# EAGLE design main_board (EAGLE 7.4.0)
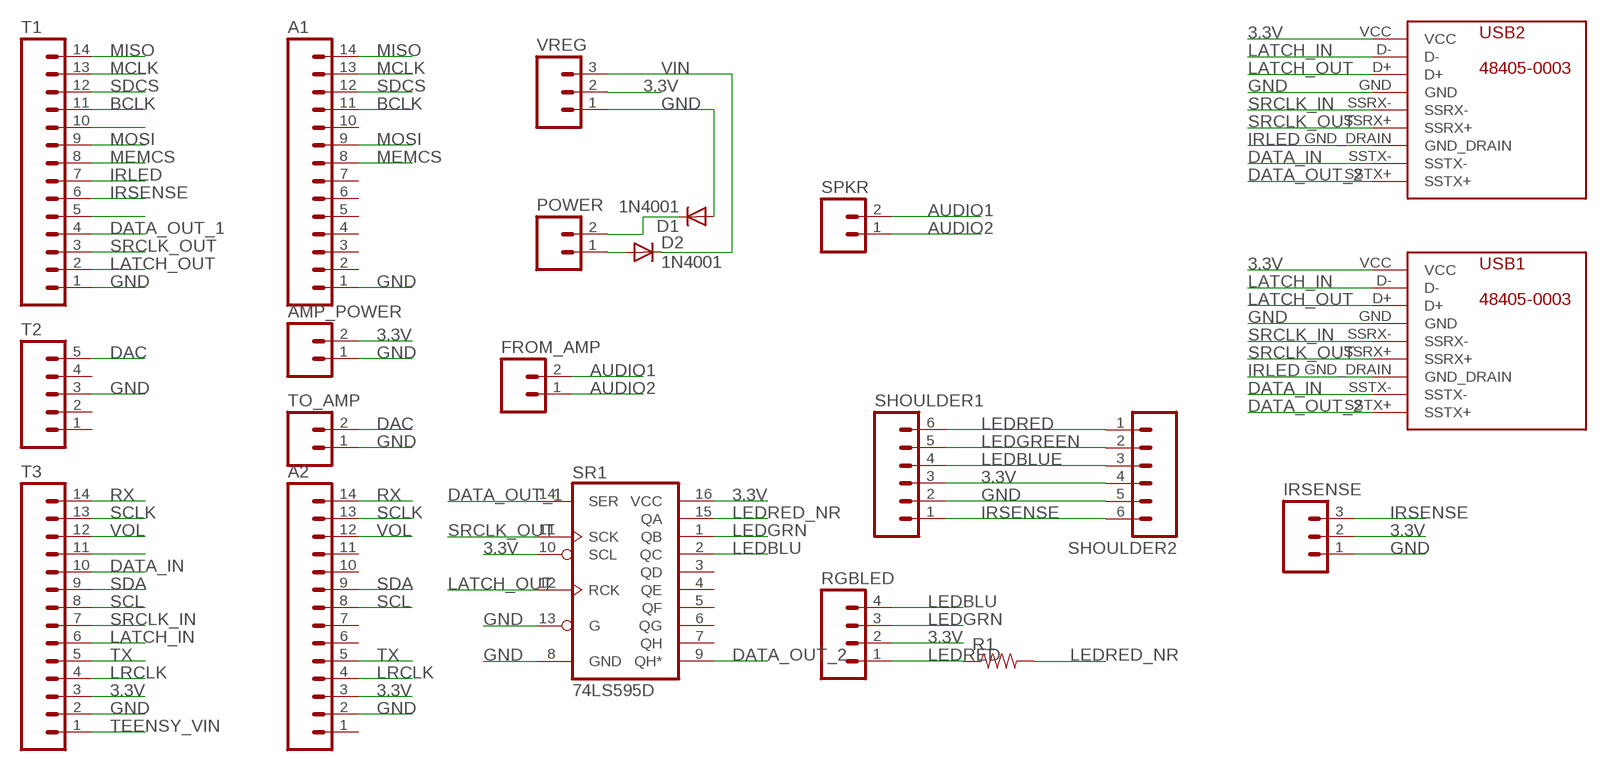
[diagram p0: schematic, sheet 1]

## Parts
A1  M14  [1X14]
A2  M14  [1X14]
AMP_POWER  M02PTH  [1X02]
D1  1N4001  1N4004  [DO41-10]
D2  1N4001  1N4004  [DO41-10]
FROM_AMP  M02PTH  [1X02]
IRSENSE  M03PTH  [1X03]
POWER  M02PTH  [1X02]
R1  RESISTOR1206  [1206]
RGBLED  M04PTH  [1X04]
SHOULDER1  M06SILK_FEMALE_PTH  [1X06]
SHOULDER2  M06SILK_FEMALE_PTH  [1X06]
SPKR  M02PTH  [1X02]
SR1  74LS595D  [SO16]
T1  M14  [1X14]
T2  M05PTH  [1X05]
T3  M14  [1X14]
TO_AMP  M02PTH  [1X02]
USB1  48405-0003  [48405-0003MYVERSION]
USB2  48405-0003  [48405-0003MYVERSION]
VREG  M03PTH  [1X03]

## Nets
3.3V: A2.3 AMP_POWER.2 IRSENSE.2 RGBLED.2 SHOULDER1.3 SHOULDER2.4 SR1.10(SCL) SR1.16(VCC) T3.3 USB1.VCC USB2.VCC VREG.2
AUDIO1: FROM_AMP.2 SPKR.2
AUDIO2: FROM_AMP.1 SPKR.1
BCLK: A1.11 T1.11
DAC: T2.5 TO_AMP.2
DATA_IN: T3.10 USB1.SSTX- USB2.SSTX-
DATA_OUT_1: SR1.14(SER) T1.4
DATA_OUT_2: SR1.9(QH*) USB1.SSTX+ USB2.SSTX+
GND: A1.1 A2.2 AMP_POWER.1 D1.A IRSENSE.1 SHOULDER1.2 SHOULDER2.5 SR1.8(GND) SR1.13(G) T1.1 T2.3 T3.2 TO_AMP.1 USB1.GND USB2.GND VREG.1
IRLED: T1.7 USB1.GND_DRAIN USB2.GND_DRAIN
IRSENSE: IRSENSE.3 SHOULDER1.1 SHOULDER2.6 T1.6
LATCH_IN: T3.6 USB1.D- USB2.D-
LATCH_OUT: SR1.12(RCK) T1.2 USB1.D+ USB2.D+
LEDBLU: RGBLED.4 SR1.2(QC)
LEDBLUE: SHOULDER1.4 SHOULDER2.3
LEDGREEN: SHOULDER1.5 SHOULDER2.2
LEDGRN: RGBLED.3 SR1.1(QB)
LEDRED: R1.1 RGBLED.1 SHOULDER1.6 SHOULDER2.1
LEDRED_NR: R1.2 SR1.15(QA)
LRCLK: A2.4 T3.4
MCLK: A1.13 T1.13
MEMCS: A1.8 T1.8
MISO: A1.14 T1.14
MOSI: A1.9 T1.9
N$1: D2.A POWER.1
N$2: D1.C POWER.2
N$5: T1.5
N$13: T3.11
N$31: T1.10
RX: A2.14 T3.14
SCL: A2.8 T3.8
SCLK: A2.13 T3.13
SDA: A2.9 T3.9
SDCS: A1.12 T1.12
SRCLK_IN: T3.7 USB1.SSRX- USB2.SSRX-
SRCLK_OUT: SR1.11(SCK) T1.3 USB1.SSRX+ USB2.SSRX+
TEENSY_VIN: T3.1
TX: A2.5 T3.5
VIN: D2.C VREG.3
VOL: A2.12 T3.12
Unconnected: A1.2 A1.3 A1.4 A1.5 A1.6 A1.7 A1.10 A2.1 A2.6 A2.7 A2.10 A2.11 SR1.3(QD) SR1.4(QE) SR1.5(QF) SR1.6(QG) SR1.7(QH) T2.1 T2.2 T2.4

## Library data of the parts
A1 A2 T1 T3 = SparkFun-Connectors:M14: Header 14 Standard 14-pin 0.1" header. Use with straight break away headers (SKU : PRT-00116), right angle break away headers (PRT-00553), swiss pins (PRT-00743), machine pins (PRT-00117), and female headers (PRT-00115).
AMP_POWER FROM_AMP POWER SPKR TO_AMP = SparkFun-Connectors:M02: Standard 2-pin 0.1" header. Use with - straight break away headers ( PRT-00116) - right angle break away headers (PRT-00553) - swiss pins (PRT-00743) - machine pins (PRT-00117) - female headers (PRT-00115) Molex polarized connector foot print use with: PRT-08233 with associated crimp pins and housings. 2.54_SCREWTERM for use with PRT-10571. 3.5mm Screw Terminal footprints for PRT-08084 5mm Screw Terminal footprints for use with PRT-08432
D1 D2 = adafruit:1N4004: DIODE General purpose 1N400x type rectifier (With bigger pads) http://www.ladyada.net/library/pcb/eaglelibrary.html
IRSENSE VREG = SparkFun-Connectors:M03: Header 3 Standard 3-pin 0.1" header. Use with straight break away headers (SKU : PRT-00116), right angle break away headers (PRT-00553), swiss pins (PRT-00743), machine pins (PRT-00117), and female headers (PRT-00115). Molex polarized connector foot print use with SKU : PRT-08232 with associated crimp pins and housings.
R1 = SparkFun-Passives:RESISTOR: Resistor Basic schematic elements and footprints for 0603, 1206, and PTH resistors.
RGBLED = SparkFun-Connectors:M04: Header 4 Standard 4-pin 0.1" header. Use with straight break away headers (SKU : PRT-00116), right angle break away headers (PRT-00553), swiss pins (PRT-00743), machine pins (PRT-00117), and female headers (PRT-00115). Molex polarized connector foot print use with SKU : PRT-08231 with associated crimp pins and housings. 1MM SMD Version SKU: PRT-10208; PROD_ID: CONN-09696
SHOULDER1 SHOULDER2 = SparkFun-Connectors:M06: Header 6 Standard 6-pin 0.1" header. Use with straight break away headers (SKU : PRT-00116), right angle break away headers (PRT-00553), swiss pins (PRT-00743), machine pins (PRT-00117), and female headers (PRT-00115). Molex polarized connector foot print use with SKU : PRT-08094 with associated crimp pins and housings. NOTES ON THE VARIANTS LOCK and LOCK_LONGPADS... This footprint was designed to help hold the alignment of a through-hole component (i.e. 6-pin header) while soldering it into place. You may notice that each hole has been shifted either up or down by 0.005 of an inch from it's more standard position (which is a perfectly straight line). This slight alteration caused the pins (the squares in the middle) to touch the edges of the holes. Because they are alternating, it causes a "brace" to hold the component in place. 0.005 has proven to be the perfect amount of "off-center" position when using our standard breakaway headers. Although looks a little odd when you look at the bare footprint, once you have a header in there, the alteration is very hard to notice. Also,if you push a header all the way into place, it is covered up entirely on the bottom side. This idea of altering the position of holes to aid alignment will be further integrated into the Sparkfun Library for other footprints. It can help hold any component with 3 or more connection pins.; PROD_ID: CONN-08437
SR1 = SparkFun-DigitalIC:74*595: 8-bit SHIFT REGISTER, output latch; PROD_ID: IC-07875
T2 = SparkFun-Connectors:M05: Header 5 Standard 5-pin 0.1" header. Use with straight break away headers (SKU : PRT-00116), right angle break away headers (PRT-00553), swiss pins (PRT-00743), machine pins (PRT-00117), and female headers (PRT-00115). Molex polarized connector foot print use with SKU : PRT-08230 with associated crimp pins and housings.
USB1 USB2 = my_try:48405-0003: USB 3.0 connector attempt, MOLEX 48405-0003

## Net classes
0 default: width 0.406 mm, drill 0.381 mm, clearance 0.305 mm

## Board
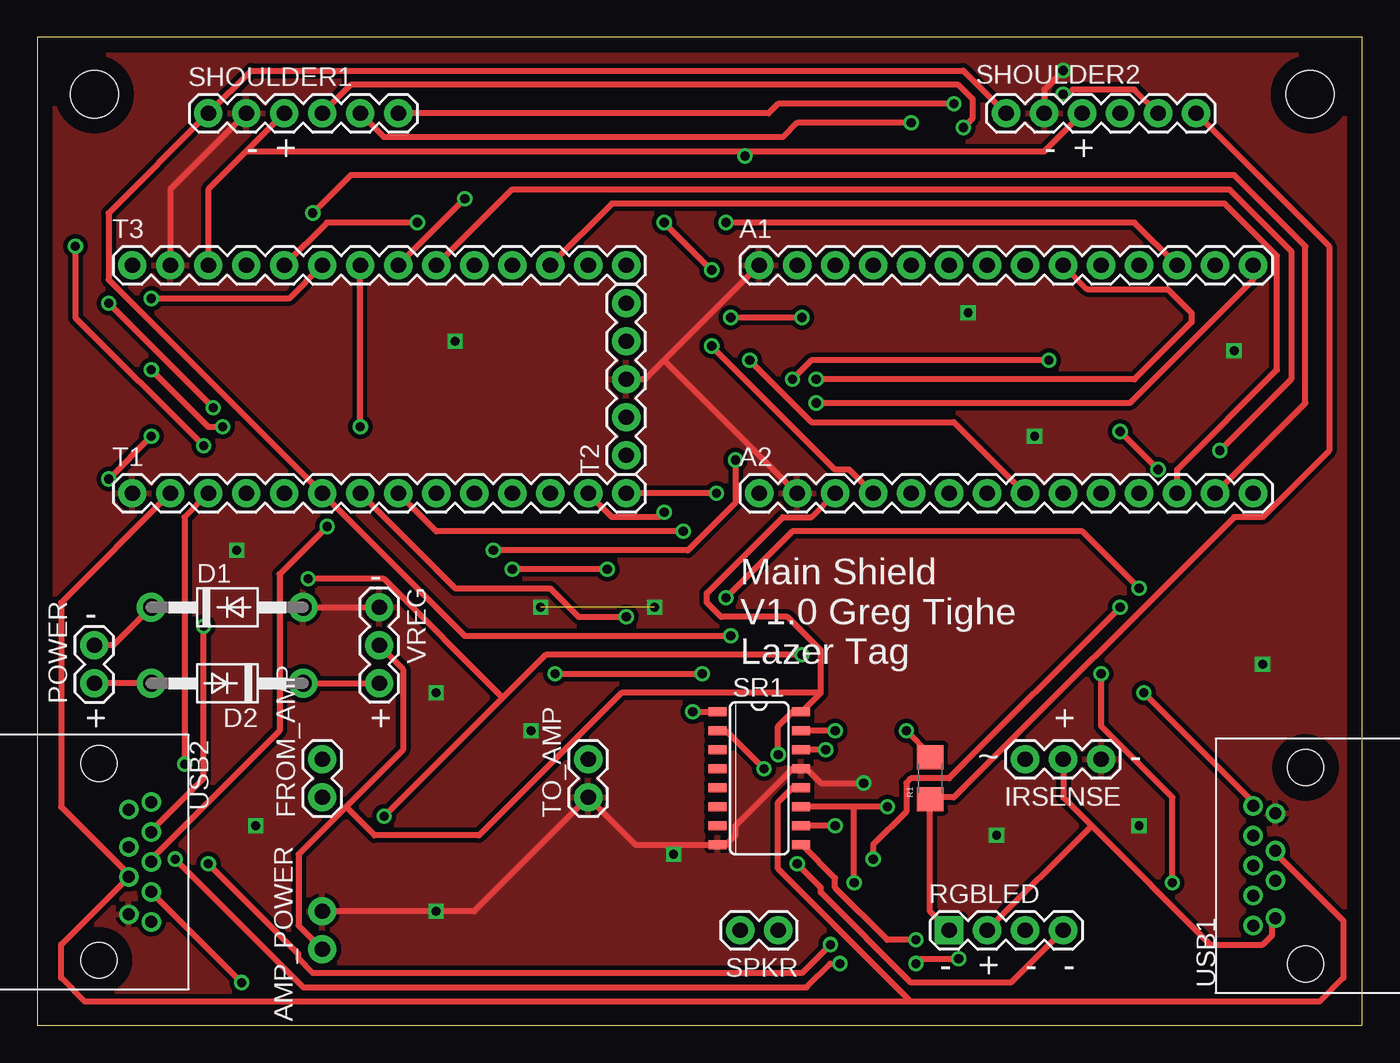
[diagram p1: board, top side]
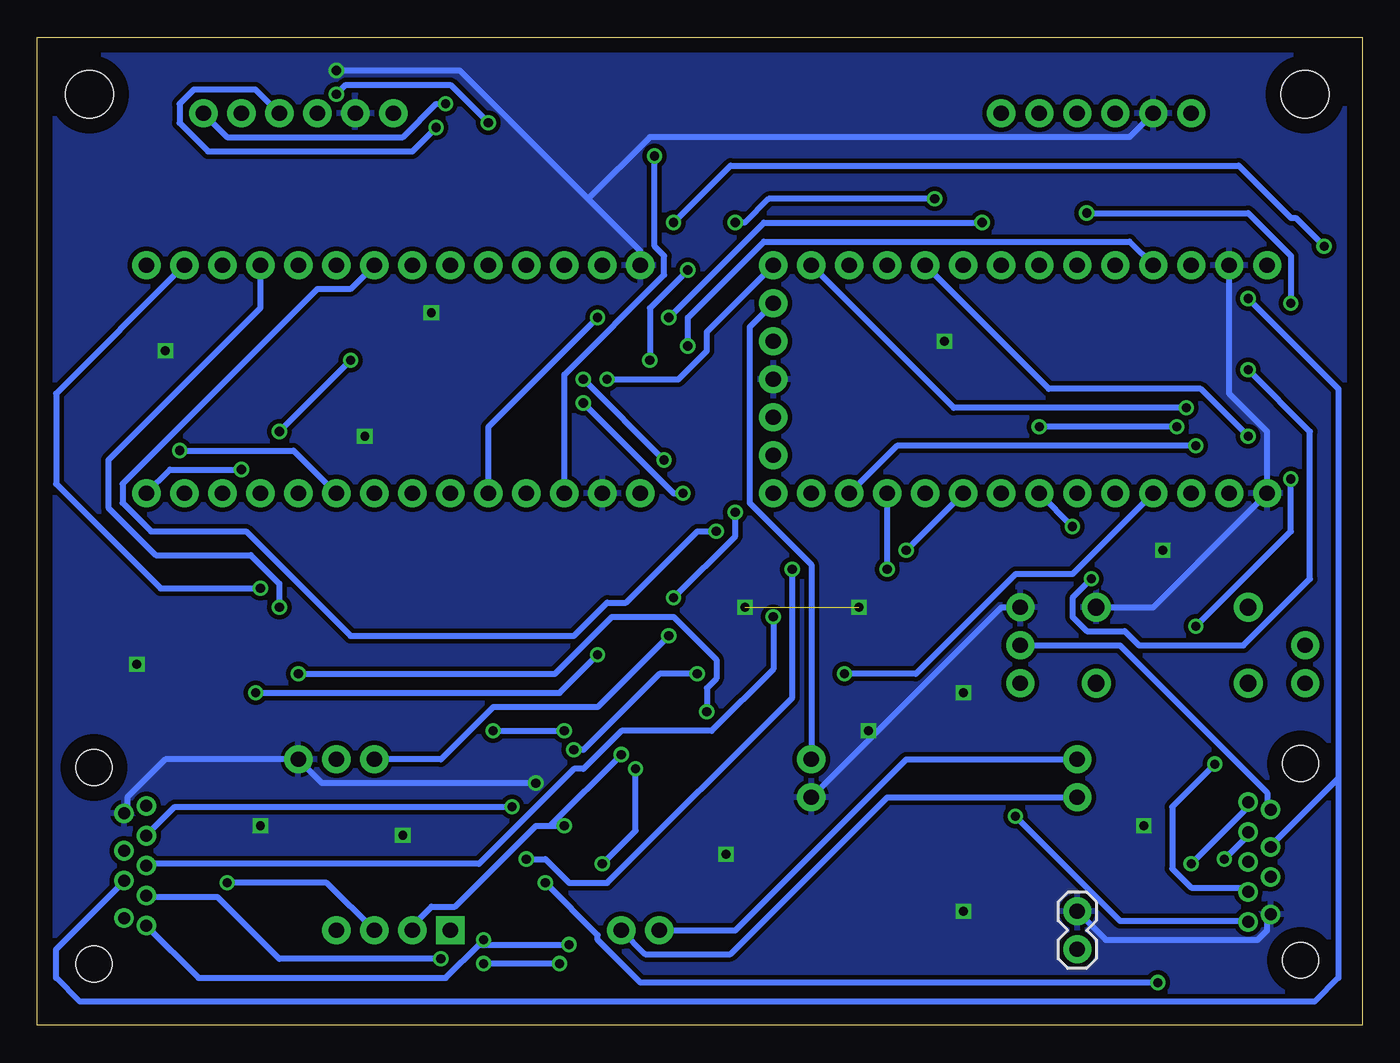
[diagram p2: board, bottom side, seen from below]

Size 88.57 x 66.03 mm. Coordinates in mm from the lower left corner, seen from the top.
Outline: 0,0 88.57,0 88.57,66.03 0,66.03 0,0
Copper layers (1*16): Top 0.035mm / dielectric 1.5mm / Bottom 0.035mm
Design rules "default": minimum track width 10mil, minimum drill 24mil, track to track 8mil, track to pad 8mil, pad to pad 8mil, via to via 8mil, smd to smd 8mil, copper to edge 40mil, drill to drill 8mil, minimum pad ring 10mil, minimum via ring 8mil, stop-mask expansion 4mil, vias tented up to drill 0mil, thermal gap 10mil
Holes 3.2 mm at 85.09,62.23 3.81,62.23

### Footprints (pad centres in the part's own frame; a part is rotated, then mirrored left to right if it is on the bottom)
1X14 = drill 1.016 pad 1.88: 1 0,0; 2 2.54,0; 3 5.08,0; 4 7.62,0; 5 10.16,0; 6 12.7,0; 7 15.24,0; 8 17.78,0; 9 20.32,0; 10 22.86,0; 11 25.4,0; 12 27.94,0; 13 30.48,0; 14 33.02,0
1X02 = drill 1.016 pad 1.88: 1 0,0; 2 2.54,0
DO41-10 = drill 1.118 pad 1.93: A 5.08,0; C -5.08,0
1X03 = drill 1.016 pad 1.88: 1 0,0; 2 2.54,0; 3 5.08,0
1206 = smd 1.6 x 1.8: 1 -1.4,0; 2 1.4,0
1X04 = drill 1.016 pad 1.88 square: 1 0,0 | drill 1.016 pad 1.88: 2 2.54,0; 3 5.08,0; 4 7.62,0
1X06 = drill 1.016 pad 1.88: 1 0,0; 2 2.54,0; 3 5.08,0; 4 7.62,0; 5 10.16,0; 6 12.7,0
SO16 = smd 0.6 x 1.2: 1 -4.445,-2.8; 2 -3.175,-2.8; 3 -1.905,-2.8; 4 -0.635,-2.8; 5 0.635,-2.8; 6 1.905,-2.8; 7 3.175,-2.8; 8 4.445,-2.8; 9 4.445,2.8; 10 3.175,2.8; 11 1.905,2.8; 12 0.635,2.8; 13 -0.635,2.8; 14 -1.905,2.8; 15 -3.175,2.8; 16 -4.445,2.8
1X05 = drill 1.016 pad 1.88: 1 0,0; 2 2.54,0; 3 5.08,0; 4 7.62,0; 5 10.16,0
48405-0003MYVERSION = drill 0.8: D+ -6.11,-2.77; D- -8.11,-2.77; GND -3.61,-2.77; GND_DRAIN -7.11,-1.27; SSRX+ -5.11,-1.27; SSRX- -3.11,-1.27; SSTX+ -11.11,-1.27; SSTX- -9.11,-1.27; VCC -10.61,-2.77 | hole 2.4: -13.68,-4.77; -0.54,-4.77

### Placement (x,y rotation side)
A1  48.26,50.8 0 top
A2  48.26,35.56 0 top
AMP_POWER  19.05,7.62 270 bottom
D1  12.7,27.94 0 top
D2  12.7,22.86 180 top
FROM_AMP  19.05,15.24 90 top
IRSENSE  71.12,17.78 180 top
POWER  3.81,22.86 90 top
R1  59.69,16.51 90 top
RGBLED  60.96,6.35 0 top
SHOULDER1  11.43,60.96 0 top
SHOULDER2  77.47,60.96 180 top
SPKR  49.53,6.35 180 top
SR1  48.26,16.51 270 top
T1  6.35,35.56 0 top
T2  39.37,38.1 90 top
T3  6.35,50.8 0 top
TO_AMP  36.83,15.24 90 top
USB1  80.01,17.78 90 top
USB2  8.89,3.81 270 top
VREG  22.86,27.94 270 top

### Tracks (layer width: path | path; a pad name or v marks a point on that pad's centre or on a via)
3.3V  (via drill 0.61)
  Top 0.406: T3.3 11.43,55.88 13.97,58.42 | SHOULDER1.3 13.97,58.42 | SHOULDER2.4 67.31,58.42 47.31,58.42 | 13.97,58.42 47.31,58.42 | AMP_POWER.2 17.46,6.67 17.46,11.43 20.64,14.61 | 20.64,14.61 24.45,18.41 24.45,23.81 VREG.2 | 70.48,13.34 68.58,15.24 IRSENSE.2 | 70.48,13.34 78.42,5.4 81.92,5.4 82.55,6.03 82.55,6.99 USB1.VCC | v53.34,13.34 SR1.10 | v49.53,18.1 49.53,20 50.48,20.95 SR1.16 51.12,20.95 52.39,22.23 | A2.3 51.75,33.97 49.85,33.97 44.77,28.89 44.77,28.26 45.72,27.3 50.16,27.3 52.39,25.08 52.39,22.23 | RGBLED.2 70.48,13.34 | 20.64,14.61 22.54,12.7 29.53,12.7 39.05,22.23 52.39,22.23 | v47.31,58.1 47.31,58.42
  Bottom 0.406: VREG.2 16.19,25.4 6.35,15.56 6.35,14.61 USB2.VCC | 54.29,13.34 55.24,13.34 60.64,7.94 62.23,7.94 63.5,6.67 RGBLED.2 | 54.29,13.34 v53.34,13.34 | 54.29,13.34 v49.53,18.1 | v47.31,58.1 47.31,52.07 46.67,51.44 46.67,50.16 53.34,43.5 A2.3
AUDIO1
  Bottom 0.406: FROM_AMP.2 30.48,17.78 41.91,6.35 SPKR.2
AUDIO2
  Bottom 0.406: FROM_AMP.1 31.75,15.24 42.23,4.76 47.94,4.76 SPKR.1
BCLK  (via drill 0.61)
  Top 0.406: v38.1,30.48 v31.75,30.48 | v55.88,11.11 55.88,12.06 58.1,14.29 58.1,16.19 58.42,16.51 60.96,16.51 v72.39,27.94
  Bottom 0.406: v31.75,30.48 T1.11 | v38.1,30.48 38.1,21.91 50.48,9.53 53.02,9.53 54.61,11.11 v55.88,11.11 | v72.39,27.94 72.39,29.53 74.3,31.43 80.64,31.43 83.82,34.61 83.82,37.78 73.66,47.94 A1.11
DAC
  Bottom 0.406: TO_AMP.2 36.83,30.8 40.96,34.92 40.96,46.67 T2.5
DATA_IN  (via drill 0.61)
  Top 0.406: v61.59,4.45 59.05,4.45 v58.74,4.13 | v53.66,4.13 53.02,4.13 51.44,2.54 17.78,2.54 v9.21,11.11 | v4.76,36.51 v7.62,39.37 | v11.11,26.67 11.11,16.51 7.62,13.02 USB2.SSTX-
  Bottom 0.406: v61.59,4.45 72.39,4.45 76.52,8.57 81.28,8.57 USB1.SSTX- | v53.66,4.13 v58.74,4.13 | v9.21,11.11 7.62,12.7 USB2.SSTX- | T3.10 20.95,42.55 10.79,42.55 v7.62,39.37 | v4.76,36.51 4.76,33.02 v11.11,26.67
DATA_OUT_1  (via drill 0.61)
  Top 0.406: v52.7,18.41 SR1.14 | v34.61,23.5 v44.45,23.5
  Bottom 0.406: v52.7,18.41 52.07,18.41 46.99,23.5 v44.45,23.5 | v34.61,23.5 29.84,23.5 23.18,30.16 19.37,30.16 T1.4
DATA_OUT_2  (via drill 0.61)
  Top 0.406: v58.74,5.71 56.83,5.71 53.34,9.21 53.34,9.84 51.12,12.06 SR1.9 | v11.43,10.79 17.46,4.76 17.46,4.45 18.41,3.49 51.12,3.49 v53.02,5.4
  Bottom 0.406: 59.05,5.4 61.28,3.17 77.79,3.17 USB1.SSTX+ | v11.43,10.79 7.62,14.61 USB2.SSTX+ | 59.05,5.4 v53.02,5.4 | 59.05,5.4 v58.74,5.71
GND  (via drill 0.6, 0.61)  (1 unrouted)
  Top 0.406: T2.3 40.64,43.18 41.91,44.45 | A1.1 41.91,44.45 | 41.91,44.45 A2.2 | SHOULDER2.5 67.31,62.55 v68.58,63.82 | T3.2 8.89,55.88 SHOULDER1.2 | D1.A VREG.1 | AMP_POWER.1 v26.67,7.62 29.21,7.62 TO_AMP.1 40.01,12.06 SR1.8 46.04,12.06 46.67,12.7 46.67,13.34 50.48,17.14 SR1.13 51.44,17.14 52.39,16.19 v55.24,16.19
  Bottom 0.406: v68.58,63.82 60.33,63.82 51.75,55.24 | 51.75,55.24 48.26,51.75 A1.1 | D1.A 13.97,27.94 T1.1 6.35,39.69 8.89,42.23 T3.2 | USB1.GND 82.55,14.29 82.55,15.24 80.01,17.78 IRSENSE.1 69.53,16.19 v55.24,16.19 | AMP_POWER.1 17.14,5.71 6.99,5.71 6.35,6.35 6.35,7.3 USB2.GND | VREG.1 24.13,27.94 TO_AMP.1 | 51.75,55.24 47.62,59.37 15.56,59.37 SHOULDER1.2
  other vias: 27.94,45.72 62.23,47.62 66.67,39.37 80.01,45.09 81.92,24.13 64.14,12.7 73.66,13.34 42.55,11.43 41.27,27.94 33.66,27.94 13.34,31.75 14.61,13.34 33.02,19.68 26.67,22.23
  pour Bottom: 0,66.04 88.9,66.04 88.9,0 0,0
  pour Top: 0,66.04 88.9,66.04 88.9,0 0,0
IRLED  (via drill 0.61)
  Top 0.406: v19.37,33.34 16.19,30.16 16.19,19.68 7.62,11.11 USB2.GND_DRAIN | v39.37,27.3 36.2,27.3 34.29,29.21 27.94,29.21 T1.7
  Bottom 0.406: T1.7 v19.37,33.34 | v39.37,27.3 39.37,23.81 43.5,19.68 49.53,19.68 52.07,17.14 52.7,17.14 59.05,10.79 81.28,10.79 USB1.GND_DRAIN
IRSENSE  (via drill 0.61)
  Top 0.406: v46.35,26.04 28.57,26.04 T1.6 4.76,49.85 4.76,54.29 SHOULDER1.1 14.29,63.82 61.91,63.82 SHOULDER2.6
  Bottom 0.406: IRSENSE.3 61.59,17.78 58.1,21.27 51.12,21.27 v46.35,26.04
LATCH_IN  (via drill 0.61)
  Top 0.406: v7.62,48.58 16.83,48.58 T3.6
  Bottom 0.406: 1.59,16.51 6.03,12.06 USB2.D- | 1.59,16.51 1.59,42.55 v7.62,48.58 | 1.59,16.51 1.59,3.17 3.17,1.59 85.72,1.59 87.31,3.17 87.31,5.08 82.87,9.53 USB1.D-
LATCH_OUT
  Top 0.406: T1.2 1.59,28.26 1.59,14.61 6.03,10.16 USB2.D+ 6.03,9.84 1.59,5.4 1.59,3.17 3.17,1.59 58.42,1.59 | SR1.12 50.48,15.88 49.53,14.92 49.53,10.48 58.42,1.59 | 58.42,1.59 85.72,1.59 87.31,3.17 87.31,6.99 82.87,11.43 USB1.D+
LEDBLU  (via drill 0.61)
  Top 0.406: SR1.2 46.04,19.68 v48.58,17.14 | v50.8,10.79 52.39,9.21 52.39,8.89 58.42,2.86 65.09,2.86 RGBLED.4
  Bottom 0.406: v48.58,17.14 48.58,13.02 v50.8,10.79
LEDBLUE  (via drill 0.61)
  Top 0.406: SHOULDER1.4 20.95,62.87 61.59,62.87 62.55,61.91 62.55,60.64 v61.91,60.01
  Bottom 0.406: v61.91,60.01 63.5,58.42 77.15,58.42 79.06,60.33 79.06,61.59 78.11,62.55 73.98,62.55 SHOULDER2.3
LEDGREEN  (via drill 0.61)
  Top 0.406: SHOULDER1.5 23.18,59.37 49.85,59.37 50.8,60.33 v58.42,60.33 | v68.58,62.23 68.9,62.23 69.22,62.55 73.34,62.55 SHOULDER2.2
  Bottom 0.406: v58.42,60.33 60.96,62.87 67.94,62.87 v68.58,62.23
LEDGRN  (via drill 0.61)
  Top 0.406: v43.81,20.95 SR1.1 | v71.12,23.5 71.12,20 75.88,15.24 v75.88,9.53
  Bottom 0.406: v43.81,20.95 43.81,22.54 43.18,23.18 43.18,24.45 46.04,27.3 50.16,27.3 53.98,23.5 v71.12,23.5 | v75.88,9.53 69.22,9.53 RGBLED.3
LEDRED  (via drill 0.61)
  Top 0.406: RGBLED.1 59.69,7.62 R1.1 59.69,15.24 61.28,15.24 80.01,33.97 81.92,33.97 86.36,38.42 86.36,52.07 SHOULDER2.1 | SHOULDER1.6 48.9,60.96 49.53,61.59 v61.28,61.59
  Bottom 0.406: v61.28,61.59 61.91,61.59 64.14,59.37 75.88,59.37 SHOULDER2.1
LEDRED_NR  (via drill 0.61)
  Top 0.406: v53.34,19.68 SR1.15 | v58.1,19.68 59.69,18.1 R1.2
  Bottom 0.406: v58.1,19.68 v53.34,19.68
LRCLK  (via drill 0.61)
  Top 0.406: v45.09,45.4 53.34,37.15 54.29,37.15 A2.4
  Bottom 0.406: T3.4 15.56,52.39 40.01,52.39 45.09,47.31 v45.09,45.4
MCLK  (via drill 0.61)
  Top 0.406: T1.13 38.42,33.97 41.59,33.97 v41.91,34.29 | v46.04,28.57 50.48,33.02 69.85,33.02 v73.66,29.21
  Bottom 0.406: v41.91,34.29 41.91,32.7 v46.04,28.57 | v73.66,29.21 80.33,29.21 87.31,36.2 87.31,42.23 A1.13
MEMCS  (via drill 0.61)
  Top 0.406: T1.8 26.67,33.02 v43.18,33.02
  Bottom 0.406: v43.18,33.02 44.45,33.02 49.21,28.26 50.48,28.26 52.7,26.04 67.63,26.04 74.61,33.02 80.96,33.02 82.87,34.92 82.87,36.2 69.85,49.21 67.63,49.21 A1.8
MISO  (via drill 0.61)
  Top 0.406: v45.4,35.56 T1.14 | v52.07,41.59 73.03,41.59 81.28,49.85 A1.14
  Bottom 0.406: v45.4,35.56 46.04,35.56 v52.07,41.59
MOSI  (via drill 0.61)
  Top 0.406: v30.48,31.75 43.5,31.75 46.67,34.92 v46.67,37.78 | v52.07,43.18 73.34,43.18 77.15,46.99 77.15,47.62 75.56,49.21 70.17,49.21 A1.9
  Bottom 0.406: v30.48,31.75 T1.9 | v52.07,43.18 v46.67,37.78
N$1
  Top 0.406: D2.A POWER.1
N$2
  Top 0.406: POWER.2 5.08,25.4 D1.C
RX  (via drill 0.61)
  Top 0.406: v50.48,43.18 51.75,44.45 v67.63,44.45 | v74.93,37.15 v72.39,39.69
  Bottom 0.406: T3.14 43.81,46.35 43.81,45.09 45.72,43.18 v50.48,43.18 | v72.39,39.69 v67.63,44.45 | v74.93,37.15 79.69,37.15 A2.14
SCL  (via drill 0.61)
  Top 0.406: A2.8 61.28,40.32 51.75,40.32 v47.62,44.45 | v41.91,53.66 v45.09,50.48 | T3.8 v28.57,55.24
  Bottom 0.406: v47.62,44.45 47.62,47.94 v45.09,50.48 | v41.91,53.66 41.27,53.66 39.69,55.24 v28.57,55.24
SCLK  (via drill 0.61)
  Top 0.406: v4.76,48.26 v11.75,41.27 | v18.41,54.29 20.95,56.83 80.01,56.83 84.77,52.07 84.77,41.59 A2.13
  Bottom 0.406: T3.13 27.3,41.27 v11.75,41.27 | v4.76,48.26 4.76,51.44 7.62,54.29 v18.41,54.29
SDA  (via drill 0.61)
  Top 0.406: v79.06,38.42 83.82,43.18 83.82,51.75 79.69,55.88 31.75,55.88 T3.9
  Bottom 0.406: A2.9 71.44,38.42 v79.06,38.42
SDCS  (via drill 0.61)
  Top 0.406: v11.11,38.73 2.54,47.31 v2.54,52.07 | v46.04,53.66 73.34,53.66 A1.12
  Bottom 0.406: T1.12 31.11,38.73 v11.11,38.73 | v2.54,52.07 4.45,53.98 4.76,53.98 8.26,57.47 42.23,57.47 v46.04,53.66
SRCLK_IN  (via drill 0.61)
  Top 0.406: 31.11,21.91 33.97,24.77 v51.12,24.77 | 31.11,21.91 v23.18,13.97 | v73.98,22.23 81.28,14.92 USB1.SSRX- | v21.59,40.01 T3.7 | v12.38,40.01 11.43,40.01 v7.62,43.81 | v18.1,29.84 23.18,29.84 31.11,21.91
  Bottom 0.406: v23.18,13.97 16.19,6.99 7.62,6.99 USB2.SSRX- | v51.12,24.77 53.66,22.23 v73.98,22.23 | v12.38,40.01 v21.59,40.01 | v7.62,43.81 3.49,39.69 3.49,29.84 7.94,25.4 14.92,25.4 15.88,26.35 18.41,26.35 19.37,27.3 19.37,28.57 v18.1,29.84
SRCLK_OUT  (via drill 0.61)
  Top 0.406: v56.83,14.61 54.61,14.61 | 54.61,14.61 SR1.11 | v9.84,17.46 9.84,33.97 T1.3 | v54.61,9.53 54.61,14.61 | v13.65,2.86 7.62,8.89 USB2.SSRX+
  Bottom 0.406: v56.83,14.61 79.38,14.61 81.28,12.7 USB1.SSRX+ | v9.84,17.46 12.7,14.61 12.7,10.48 11.43,9.21 7.62,9.21 USB2.SSRX+ | v54.61,9.53 51.12,6.03 51.12,5.71 48.26,2.86 v13.65,2.86
TX  (via drill 0.61)
  Top 0.406: T3.5 19.37,53.66 v25.4,53.66 | v51.12,47.31 v46.35,47.31
  Bottom 0.406: v25.4,53.66 40.01,53.66 v46.35,47.31 | v51.12,47.31 58.42,40.01 A2.5
VIN
  Top 0.406: D2.C VREG.3
VOL
  Top 0.406: T3.12 38.42,54.93 79.38,54.93 82.87,51.44 82.87,43.81 76.2,37.15 A2.12

### Text on the board
tNames: - | + | - | + | - | - | Main Shield / V1.0 Greg Tighe / Lazer Tag | + | + | + | ~ | - | - | + | - | -